# Altium schematic sheet Sheet1.SchDoc
size A4
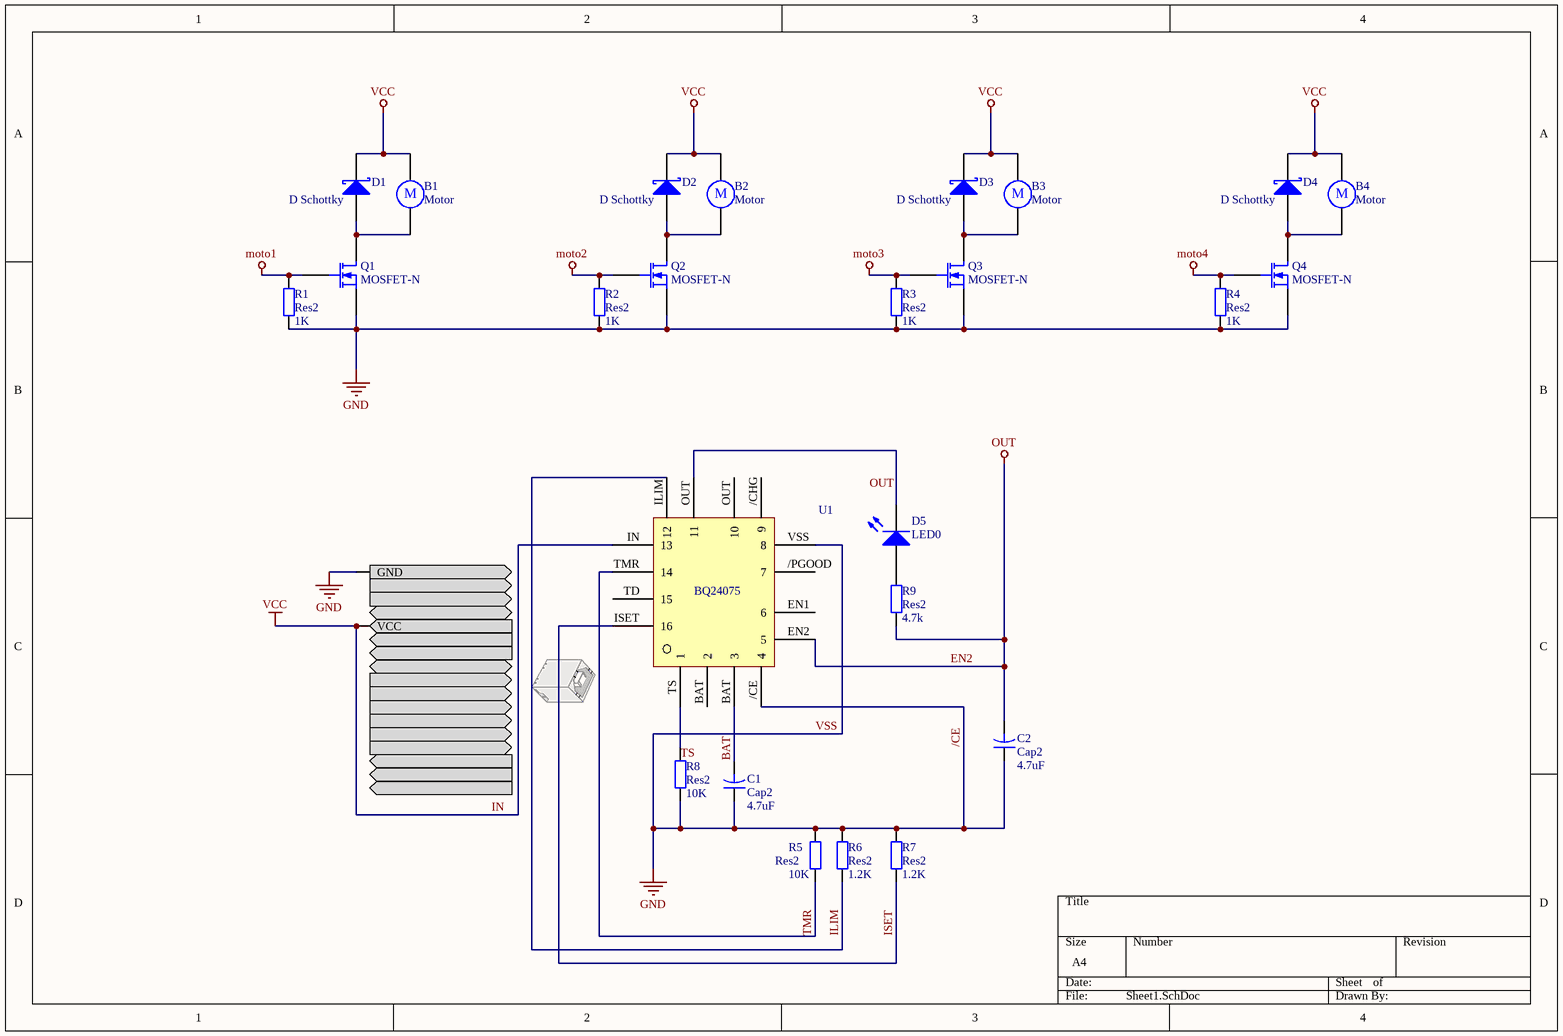
[diagram p0: Sheet1.SchDoc]

## Parts
?  USB  (value not drawn)
B1  Motor  [RB5-10.5]
B2  Motor  [RB5-10.5]
B3  Motor  [RB5-10.5]
B4  Motor  [RB5-10.5]
C1  Cap2  value 4.7uF  [CAPR5-4X5]
C2  Cap2  value 4.7uF  [CAPR5-4X5]
D1  D Schottky  [SMB]
D2  D Schottky  [SMB]
D3  D Schottky  [SMB]
D4  D Schottky  [SMB]
D5  LED0  [LED-0]
Q1  MOSFET-N  [E3]
Q2  MOSFET-N  [E3]
Q3  MOSFET-N  [E3]
Q4  MOSFET-N  [E3]
R1  Res2  value 1K  [AXIAL-0.4]
R2  Res2  value 1K  [AXIAL-0.4]
R3  Res2  value 1K  [AXIAL-0.4]
R4  Res2  value 1K  [AXIAL-0.4]
R5  Res2  value 10K  [AXIAL-0.4]
R6  Res2  value 1.2K  [AXIAL-0.4]
R7  Res2  value 1.2K  [AXIAL-0.4]
R8  Res2  value 10K  [AXIAL-0.4]
R9  Res2  value 4.7k  [AXIAL-0.4]
U1  BQ24075  [BQ24075 - duplicate]

## Nets
/CE: ?.GND C1.1 C2.1 Q1.3(S) Q2.3(S) Q3.3(S) Q4.3(S) R1.1 R2.1 R3.1 R4.1 R5.2 R6.2 R7.2 R8.1 U1./CE(4) U1.VSS(8)  [also labelled GND, VSS]
EN2: C2.2 R9.2 U1.EN2(5)  [also labelled OUT]
IN: ?.VCC B1.1 B2.1 B3.1 B4.1 D1.2(K) D2.2(K) D3.2(K) D4.2(K) U1.IN(13)  [also labelled VCC]
moto1: Q1.2(G) R1.2
moto2: Q2.2(G) R2.2
moto3: Q3.2(G) R3.2
moto4: Q4.2(G) R4.2
BAT: C1.2 U1.BAT(2)
ILIM: R6.1 U1.ILIM(12)
ISET: R7.1 U1.ISET(16)
TMR: R5.1 U1.TMR(14)
NetB1_2: B1.2 D1.1(A) Q1.1(D)
NetB2_2: B2.2 D2.1(A) Q2.1(D)
NetB3_2: B3.2 D3.1(A) Q3.1(D)
NetB4_2: B4.2 D4.1(A) Q4.1(D)
NetD5_1: D5.1(A) R9.1
NetD5_2: D5.2(K) U1.OUT(11)
NetR8_2: R8.2 U1.TS(1)

Not connected (* = marked no-connect by the designer): U1 /CHG(9) /PGOOD(7) EN1(6) TD(15)

## Notes on the sheet
- Labels drawn without touching a wire or pin: OUT, TS
- (in symbol Motor) M

## Library data of the parts
? = USB: High Speed USB 2.0; PortComponent: True; Published: 22-Jan-2007; Publisher: Altium Limited; HelpURL: https://wiki.altium.com/display/ADOH/PB03+Resources+-+USB+Port
B1-B4 = Motor: Motor, General Kind; Published: 24-Mar-1999; LatestRevisionDate: 17-Jul-2002; LatestRevisionNote: Re-released for DXP Platform.; PackageReference: RB5-10.5; Publisher: Altium Limited; PackageDescription: Capacitor (Radial); 2 Leads
C1 C2 = Cap2: Capacitor; Published: 23-Sep-2002; PackageReference: CAPR5-4X5; Publisher: Altium Limited; PackageDescription: Capacitor; 2 Leads
D1-D4 = D Schottky: Schottky Diode; Published: 8-Jun-2000; LatestRevisionDate: 17-Jul-2002; LatestRevisionNote: Re-released for DXP Platform.; PackageReference: SMB; Publisher: Altium Limited; PackageDescription: DO-214-AA/SMB; 2 C-Bend Leads; Body 5.3 x 3.6 mm, inc. leads (LxW); Code_JEDEC: DO-214-AA
D5 = LED0: Typical INFRARED GaAs LED; Published: 8-Jun-2000; LatestRevisionDate: 08-Jul-2005; LatestRevisionNote: Mech Layer 1 removed.; PackageReference: LED-0; Publisher: Altium Limited; PackageDescription: LED; 2 Leads
Q1-Q4 = MOSFET-N: N-Channel MOSFET; Published: 8-Jun-2000; LatestRevisionDate: 17-Jul-2002; LatestRevisionNote: Re-released for DXP Platform.; PackageVersion: 1995/1996; PackageReference: E3; Publisher: Altium Limited; PackageDescription: TO, Flat Index; 3 In-Line, Axial Leads; Body Dia. 4.6mm; Lead Dia. 0.5 mm (max)
R1-R9 = Res2: Resistor; Published: 8-Jun-2000; LatestRevisionDate: 17-Jul-2002; LatestRevisionNote: Re-released for DXP Platform.; PackageReference: AXIAL-0.4; Publisher: Altium Limited; PackageDescription: Axial Device, Thru-Hole; 2 Leads; 0.4 in Pin Spacing